# Altium schematic sheet Sheet_1_2026-02-24.schdoc
size 292 x 125 mm
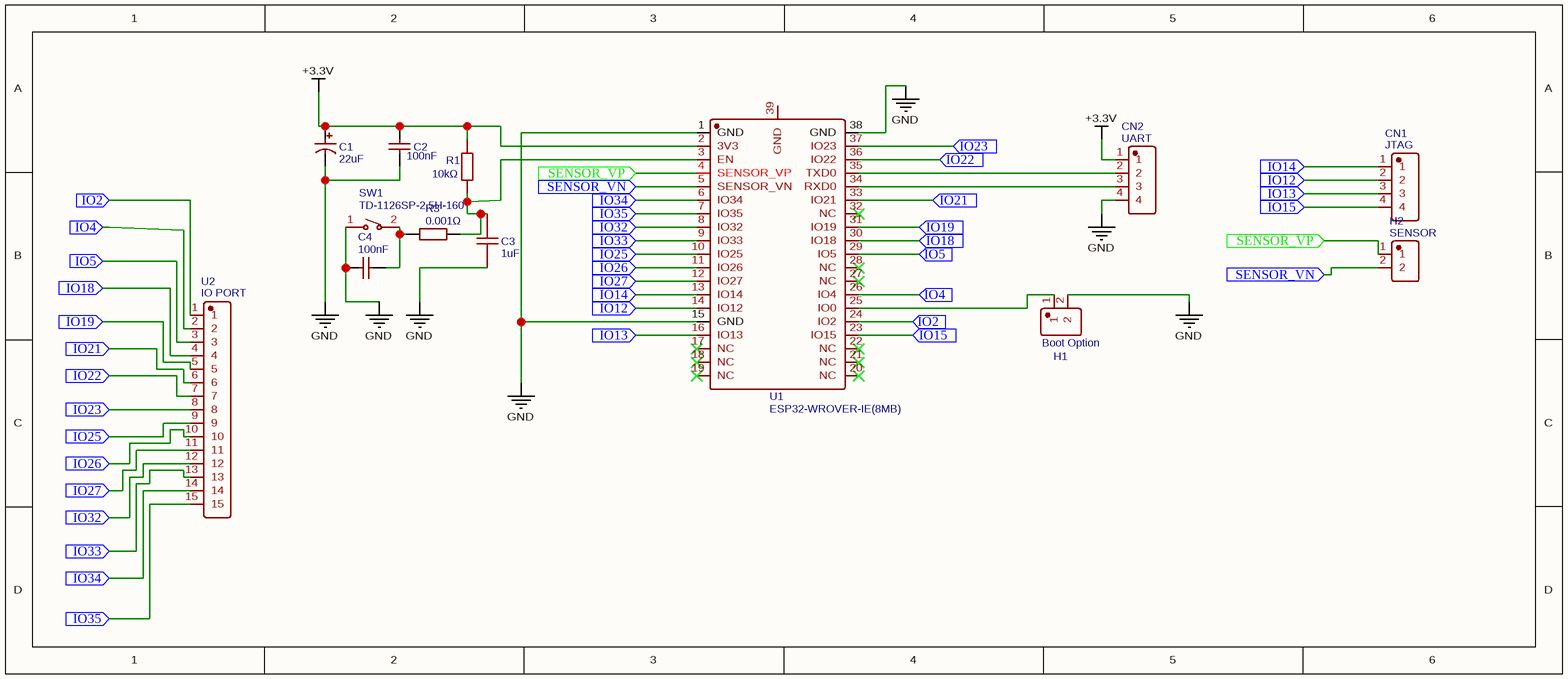
[diagram p0: Sheet_1_2026-02-24.schdoc]

## Parts
C1  22uF  [CAP-TH_BD5.0-P2.5-D0.5-FD]
C2  100nF  [CAP-TH_BD2.5-L4.3-P8.30-D0.5]
C3  1uF  [C0805]
C4  100nF  [CAP-TH_BD2.5-L4.3-P8.30-D0.5]
CN1  JTAG  [HDR-TH_4P-P2.54-V-F]
CN2  UART  [HDR-TH_4P-P2.54-V-F]
H1  Boot Option  [HDR-TH_2P-P2.54-V-M]
H2  SENSOR  [HDR-TH_2P-P2.54-V-M]
R1  10kΩ  [R0805]
R3  0.001Ω  [R2512]
SW1  TD-1126SP-2.5H-160  [SW-SMD_L6.1-W3.6-LS8.0]
U1  ESP32-WROVER-IE(8MB)  [WIFI-SMD_ESP32-WROVER-E]
U2  IO PORT  [HDR-TH_15P-P1.27-H-M-W7.0-N]

## Ports
IO2 (in), IO4 (in), IO5 (in), IO12 (in), IO13 (in), IO14 (in), IO15 (in), IO18 (in), IO19 (in), IO21 (in), IO22 (in), IO23 (in), IO25 (in), IO26 (in), IO27 (in), IO32 (in), IO33 (in), IO34 (in), IO35 (in), SENSOR_VN (in), SENSOR_VP (in)

## Nets
+3.3V: C1.1 C2.1 CN2.1 R1.1 U1.2(3V3)
GND: C1.2 C2.2 C3.2 C4.2 CN2.4 H1.2 SW1.1 U1.1(GND) U1.15(GND) U1.38(GND)
IO2: U1.24(IO2) U2.1 ; port IO2
IO4: U1.26(IO4) U2.2 ; port IO4
IO5: U1.29(IO5) U2.3 ; port IO5
IO12: CN1.2 U1.14(IO12) ; port IO12
IO13: CN1.3 U1.16(IO13) ; port IO13
IO14: CN1.1 U1.13(IO14) ; port IO14
IO15: CN1.4 U1.23(IO15) ; port IO15
IO18: U1.30(IO18) U2.4 ; port IO18
IO19: U1.31(IO19) U2.5 ; port IO19
IO21: U1.33(IO21) U2.6 ; port IO21
IO22: U1.36(IO22) U2.7 ; port IO22
IO23: U1.37(IO23) U2.8 ; port IO23
IO25: U1.10(IO25) U2.9 ; port IO25
IO26: U1.11(IO26) U2.10 ; port IO26
IO27: U1.12(IO27) U2.11 ; port IO27
IO32: U1.8(IO32) U2.12 ; port IO32
IO33: U1.9(IO33) U2.13 ; port IO33
IO34: U1.6(IO34) U2.14 ; port IO34
IO35: U1.7(IO35) U2.15 ; port IO35
SENSOR_VN: H2.2 U1.5(SENSOR_VN) ; port SENSOR_VN
SENSOR_VP: H2.1 U1.4(SENSOR_VP) ; port SENSOR_VP
NetC3_1: C3.1 R1.2 R3.2 U1.3(EN)
NetC4_1: C4.1 R3.1 SW1.2
NetCN2_2: CN2.2 U1.35(TXD0)
NetCN2_3: CN2.3 U1.34(RXD0)
NetH1_1: H1.1 U1.25(IO0)

Not connected (* = marked no-connect by the designer): U1 17(NC)* 18(NC)* 19(NC)* 20(NC)* 21(NC)* 22(NC)* 27(NC)* 28(NC)* 32(NC)* 39(GND)

## Library data of the parts
C1 = 22uF: Manufacturer: Samwha Capacitor; Manufacturer Part: RD1H226M05011PC18P; nameAlias: Capacitance; Contributor: LCSC; Supplier: LCSC; Supplier Part: C238009; JLCPCB Part Class: Extended Part; spicePre: C; spiceSymbolName: RD1H226M05011PC18P
C2 C4 = 100nF: Manufacturer: FH; Manufacturer Part: CT42-104K17B500P; nameAlias: Capacitance; Contributor: LCSC; Supplier: LCSC; Supplier Part: C94705; JLCPCB Part Class: Extended Part; spicePre: C; spiceSymbolName: CT42-104K17B500P
C3 = 1uF: Manufacturer: Samwha Capacitor; Manufacturer Part: CS2012X7R105K500NRE; nameAlias: Capacitance; Contributor: LCSC; Supplier: LCSC; Supplier Part: C516002; JLCPCB Part Class: Extended Part; spicePre: C; spiceSymbolName: CS2012X7R105K500NRE
CN1 = JTAG: Manufacturer: null; Contributor: LCSC; Supplier: LCSC; Supplier Part: C9900002996; Manufacturer Part: JTAG; JLCPCB Part Class: Extended Part; spicePre: C; spiceSymbolName: JTAG
CN2 = UART: Manufacturer: null; Manufacturer Part: JTAG; Contributor: LCSC; Supplier: LCSC; Supplier Part: C9900002996; JLCPCB Part Class: Extended Part; spicePre: C; spiceSymbolName: JTAG
H1 = Boot Option: Manufacturer: CJT(长江连接器); Manufacturer Part: A2541WV-2P; Contributor: lcsc; Supplier: LCSC; Supplier Part: C3202445; link: https://atta.szlcsc.com/upload/public/pdf/source/20220627/DAEB5ABA9C700D8C7B36B6A13450D2A5.pdf; spicePre: H; spiceSymbolName: A2541WV-2P_C3202445
H2 = SENSOR: Manufacturer: CJT(长江连接器); Manufacturer Part: A2541WV-2P; Contributor: lcsc; Supplier: LCSC; Supplier Part: C3202445; link: https://atta.szlcsc.com/upload/public/pdf/source/20220627/DAEB5ABA9C700D8C7B36B6A13450D2A5.pdf; spicePre: H; spiceSymbolName: A2541WV-2P_C3202445
R1 = 10kΩ: Manufacturer: ResistorToday; Manufacturer Part: PTFR0805B10K0N9; Resistance (Ohms): 10K; nameAlias: Resistance; Contributor: LCSC; Supplier: LCSC; Supplier Part: C328436; JLCPCB Part Class: Extended Part; spicePre: R; spiceSymbolName: PTFR0805B10K0N9
R3 = 0.001Ω: Manufacturer: ResistorToday; Manufacturer Part: ECSR2512FR001K9; nameAlias: Resistance; Contributor: LCSC; Resistance (Ohms): 0.001; Supplier: LCSC; Supplier Part: C349181; JLCPCB Part Class: Extended Part; spicePre: R; spiceSymbolName: ECSR2512FR001K9
SW1 = TD-1126SP-2.5H-160: Manufacturer: DEALON(德艺隆); Contributor: LCSC; Supplier: LCSC; Supplier Part: C2905166; Manufacturer Part: TD-1126SP-2.5H-160; JLCPCB Part Class: Extended Part; spicePre: S; spiceSymbolName: TD-1126SP-2.5H-160
U1 = ESP32-WROVER-IE(8MB): Manufacturer: Espressif Systems; Contributor: LCSC; Supplier: LCSC; Supplier Part: C701351; Manufacturer Part: ESP32-WROVER-IE(8MB); JLCPCB Part Class: Extended Part; spicePre: U; spiceSymbolName: ESP32-WROVER-IE(8MB)
U2 = IO PORT: Manufacturer: XKB Connectivity(中国星坤); Manufacturer Part: X1311WR-15J-C26D40; Contributor: LCSC; Supplier: LCSC; Supplier Part: C2881543; JLCPCB Part Class: Extended Part; spicePre: U; spiceSymbolName: X1311WR-15J-C26D40